# EAGLE design Encoder Brick (EAGLE 9.6.1)
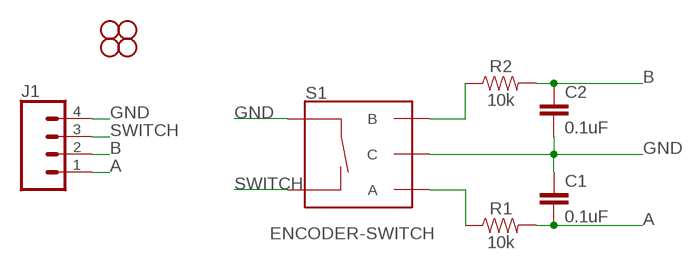
[diagram p0: schematic, sheet 1]

## Parts
C1  0.1uF  0.1UF-KIT-EZ-50V-20%  [CAP-PTH-SMALL-KIT]
C2  0.1uF  0.1UF-KIT-EZ-50V-20%  [CAP-PTH-SMALL-KIT]
J1  CONN_04POLAR  [MOLEX-1X4]
JP3  STAND-OFF  [STAND-OFF]
JP4  STAND-OFF  [STAND-OFF]
JP11  STAND-OFF  [STAND-OFF]
JP13  STAND-OFF  [STAND-OFF]
R1  10k  10KOHM-HORIZ_KIT-1/4W-1%  [AXIAL-0.3-KIT]
R2  10k  10KOHM-HORIZ_KIT-1/4W-1%  [AXIAL-0.3-KIT]
S1  ENCODER-SWITCH  [ROTARY_ENC_PLAIN]

## Nets
A: C1.2 J1.1 R1.P$2
B: C2.1 J1.2 R2.P$2
GND: C1.1 C2.2 J1.4 S1.C S1.SW+
N$8: R2.P$1 S1.B
N$10: R1.P$1 S1.A
SWITCH: J1.3 S1.SW-

## Library data of the parts
C1 C2 = SparkFun-Capacitors:0.1UF: 0.1µF ceramic capacitors A capacitor is a passive two-terminal electrical component used to store electrical energy temporarily in an electric field.; PROD_ID: CAP-08370
J1 = SparkFun-Connectors:CONN_04: Multi connection point. Often used as Generic Header-pin footprint for 0.1 inch spaced/style header connections On any of the 0.1 inch spaced packages, you can populate with these: Break Away Headers - Straight <https://www.sparkfun.com/products/116> (PRT-00116) Break Away Male Headers - Right Angle <https://www.sparkfun.com/products/553> (PRT-00553) Female Headers <https://www.sparkfun.com/products/115> (PRT-00115) Break Away Headers - Machine Pin <https://www.sparkfun.com/products/117> (PRT-00117) Break Away Female Headers - Swiss Machine Pin <https://www.sparkfun.com/products/743> (PRT-00743) For SCREWTERMINALS and SPRING TERMINALS visit here: Screw Terimnals on SparkFun.com <https://www.sparkfun.com/search/results?term=Screw+Terminals> (5mm/3.5mm/2.54mm spacing) This device is also useful as a general connection point to wire up your design to another part of your project. Our various solder wires solder well into these plated through hole pads. Hook-Up Wire - Assortment (Stranded, 22 AWG) <https://www.sparkfun.com/products/11375> (PRT-11375) Hook-Up Wire - Assortment (Solid Core, 22 AWG) <https://www.sparkfun.com/products/11367> (PRT-11367) View the entire wire category on our website here <https://www.sparkfun.com/categories/141> Special notes: Molex polarized connector foot print use with SKU : PRT-08231 with associated crimp pins and housings. 1MM SMD Version SKU: PRT-10208; PROD_ID: CONN-08186; SF_ID: PRT-08231
JP3 JP4 JP11 JP13 = SparkFun:STAND-OFF: Stand Off This is the mechanical footprint for a #4 phillips button head screw. Use the keepout ring to avoid running the screw head into surrounding components. SKU : PRT-00447
R1 R2 = SparkFun-Resistors:10KOHM: 10kΩ resistor A resistor is a passive two-terminal electrical component that implements electrical resistance as a circuit element. Resistors act to reduce current flow, and, at the same time, act to lower voltage levels within circuits. - Wikipedia; PROD_ID: RES-12183
S1 = SparkFun-Switches:ENCODER-SWITCH: Rotary Encoder w/ Select Switch Encoders rotate similarly to potentiometers, but they’re different from potentiometers in that an encoder has full rotation without limits. They output gray code so that you can tell how much and in which direction the encoder has been turned. This encoder includes a push-down select switch built into the shaft. SparkFun Products Rotary Encoder <https://www.sparkfun.com/products/9117> (COM-09117); SF_SKU: COM-09117

## Net classes
1 3.3V: width 0.152 mm

## Board
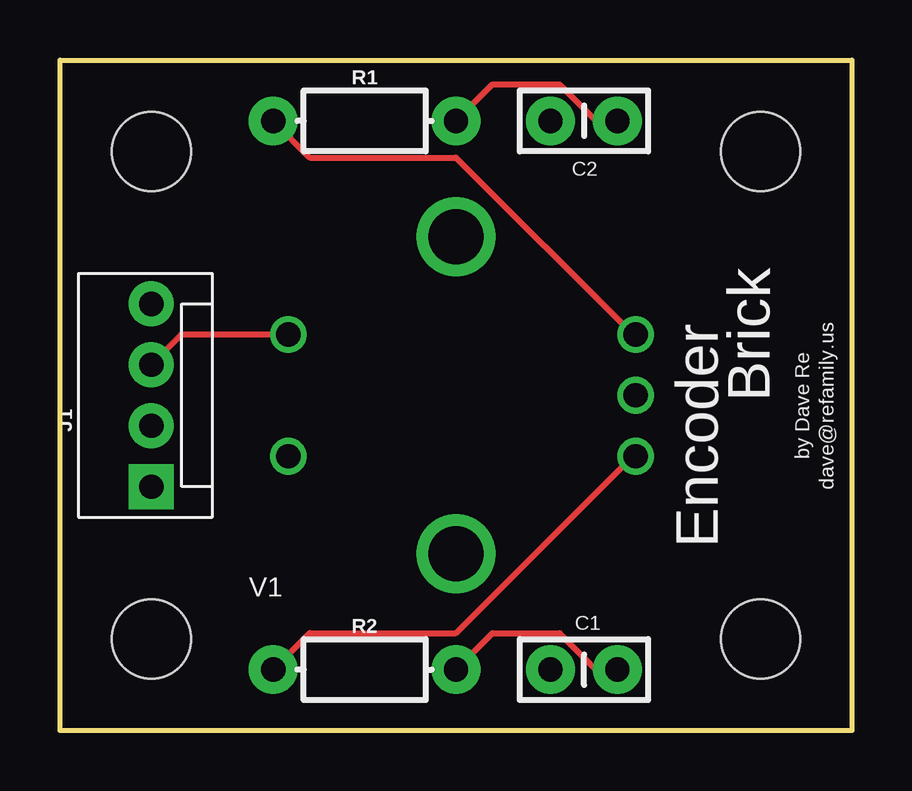
[diagram p1: board, top side]
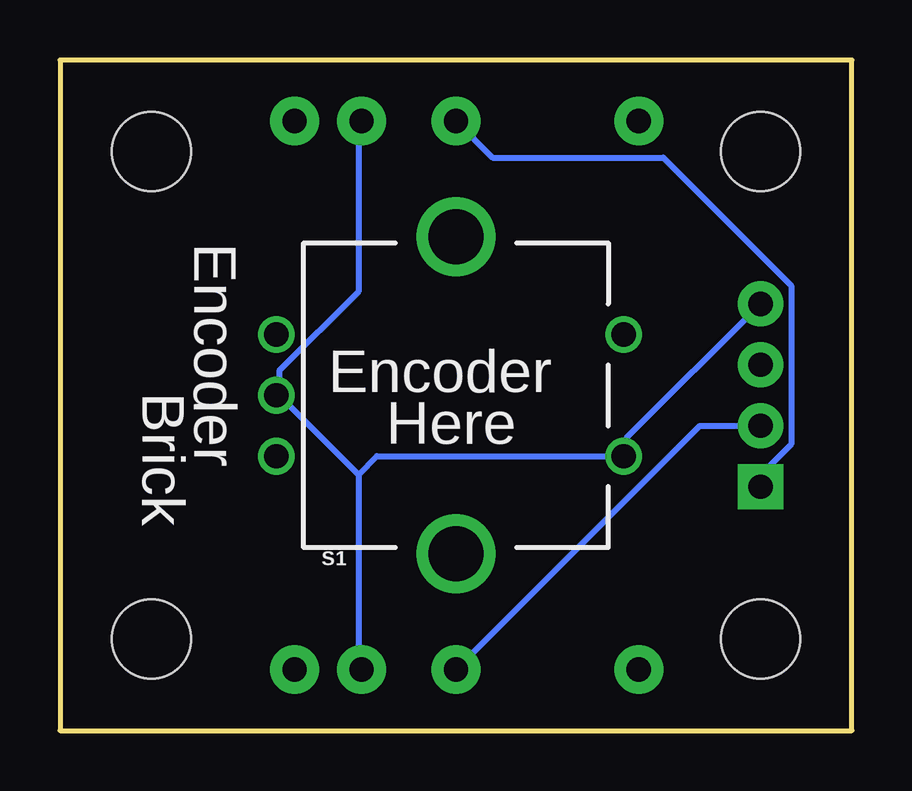
[diagram p2: board, bottom side, seen from below]

Size 33.02 x 27.94 mm. Coordinates in mm from the lower left corner, seen from the top.
Outline: 0,0 0,27.94 33.02,27.94 33.02,0 0,0
Copper layers (1*16): Top 0.035559375mm / dielectric 1.6mm / Bottom 0.035559375mm
Design rules "oshpark-2layer-auto-routing": minimum track width 10mil, minimum drill 10mil, track to track 10mil, track to pad 8mil, pad to pad 8mil, via to via 8mil, smd to smd 6mil, copper to edge 15mil, drill to drill 6mil, minimum pad ring 6mil, minimum via ring 6mil, stop-mask expansion 2.5mil, vias tented up to drill 0mil, thermal gap 10mil

### Footprints (pad centres in the part's own frame; a part is rotated, then mirrored left to right if it is on the bottom)
CAP-PTH-SMALL-KIT = drill 1.016 pad 2.032: 1 -1.397,0; 2 1.397,0
MOLEX-1X4 = drill 1.016 pad 1.88 square: 1 0,0 | drill 1.016 pad 1.88: 2 2.54,0; 3 5.08,0; 4 7.62,0
STAND-OFF = hole 3.302: 0,0
AXIAL-0.3-KIT = drill 1.016 pad 2.032: P$1 -3.81,0; P$2 3.81,0
ROTARY_ENC_PLAIN = drill 1.016: A 7.493,-2.54; B 7.493,2.54; C 7.493,0; SW+ -6.985,2.54; SW- -6.985,-2.54 | drill 2.286: P$3 0,6.604; P$4 0,-6.604

### Placement (x,y rotation side)
C1  21.84,25.4 0 top
C2  21.84,2.54 180 top
J1  3.81,10.16 90 top
JP3  3.81,24.13 0 top
JP4  29.21,24.13 0 top
JP11  3.81,3.81 0 top
JP13  29.21,3.81 0 top
R1  12.7,25.4 0 top
R2  12.7,2.54 0 top
S1  16.51,13.97 180 bottom

### Tracks (layer width: path | path; a pad name or v marks a point on that pad's centre or on a via)
A
  Top 0.254: C1.2 22.35,25.4 20.83,26.92 18.03,26.92 R1.P$2
  Bottom 0.254: J1.1 3.81,10.67 2.54,11.94 2.54,18.54 7.87,23.88 14.99,23.88 R1.P$2
B
  Top 0.254: C2.1 22.35,2.54 20.83,4.06 18.03,4.06 R2.P$2
  Bottom 0.254: J1.2 6.35,12.7 R2.P$2
GND
  Bottom 0.254: J1.4 9.4,12.19 9.4,11.43 S1.SW+ 19.81,11.43 20.57,10.67 | 23.88,13.97 23.88,14.99 20.57,18.29 20.57,25.4 C1.1 | 20.57,10.67 20.57,2.54 C2.2 | 23.88,13.97 20.57,10.67 | 23.88,13.97 S1.C
N$8
  Top 0.254: R2.P$1 10.41,4.06 16.51,4.06 23.88,11.43 S1.B
N$10
  Top 0.254: R1.P$1 10.41,23.88 16.51,23.88 23.88,16.51 S1.A
SWITCH
  Top 0.254: S1.SW- 5.08,16.51 J1.3

### Text on the board
tPlace: C2 | Brick | by Dave Re | dave@refamily.us | Encoder | V1 | C1
bPlace: Encoder | Encoder | Brick | Here